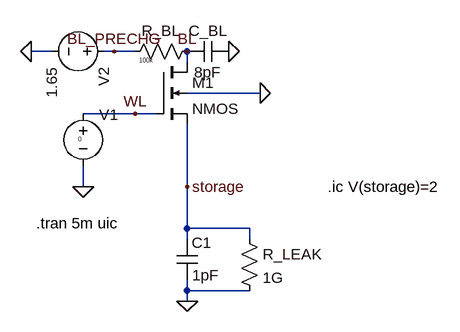
[diagram p0: schematic DRAM Cell.asc]
DRAM Cell.asc, the LTspice schematic file:
Version 4.1
SHEET 1 880 680
WIRE -176 -32 -208 -32
WIRE -80 -32 -96 -32
WIRE -48 -32 -80 -32
WIRE 32 -16 32 -32
WIRE 144 32 32 32
WIRE -48 64 -128 64
WIRE -16 64 -48 64
WIRE -128 176 -128 144
WIRE 32 176 32 80
WIRE 32 240 32 176
WIRE 128 240 32 240
WIRE 32 256 32 240
WIRE 128 256 128 240
WIRE 32 336 32 320
WIRE 128 336 32 336
WIRE 32 352 32 336
FLAG 32 352 0
FLAG -48 64 WL
FLAG -128 176 0
FLAG 32 176 storage
FLAG 144 32 0
FLAG 96 -32 0
FLAG -208 -32 0
FLAG -80 -32 BL_PRECHG
FLAG 32 -32 BL
SYMBOL cap 16 256 R0
WINDOW 0 23 6 Left 2
WINDOW 39 24 84 Left 2
SYMATTR InstName C1
SYMATTR Value 1pF
SYMBOL voltage -128 48 R0
WINDOW 0 39 2 Top 2
WINDOW 123 0 0 Left 0
WINDOW 39 0 0 Left 0
WINDOW 3 -2 55 Right 0
SYMATTR InstName V1
SYMATTR Value 0
SYMBOL nmos4 -16 -16 R0
SYMATTR InstName M1
SYMBOL cap 96 -48 R90
WINDOW 0 0 32 VBottom 2
WINDOW 3 32 32 VTop 2
SYMATTR InstName C_BL
SYMATTR Value 8pF
SYMBOL res 48 -48 R90
WINDOW 0 0 56 VBottom 2
WINDOW 3 23 79 VTop 0
SYMATTR InstName R_BL
SYMATTR Value 100k
SYMBOL voltage -80 -32 R90
WINDOW 123 0 0 Left 0
WINDOW 39 0 0 Left 0
SYMATTR InstName V2
SYMATTR Value 1.65
SYMBOL res 112 240 R0
SYMATTR InstName R_LEAK
SYMATTR Value 1G
TEXT -200 232 Left 2 !.tran 5m uic
TEXT 248 176 Left 2 !.ic V(storage)=2

The netlist it stands for:
* DRAM Cell.asc
C1 storage 0 1pF
V1 WL 0 0
M1 BL WL storage 0 NMOS
C_BL 0 BL 8pF
R_BL BL BL_PRECHG 100k
V2 BL_PRECHG 0 1.65
R_LEAK storage 0 1G
.model NMOS NMOS
.model PMOS PMOS
.lib standard.mos
.tran 5m uic
.ic V(storage)=2
.backanno
.end